# EAGLE board PinHeck Test Jig (EAGLE 6.6.0), part 1 of 2
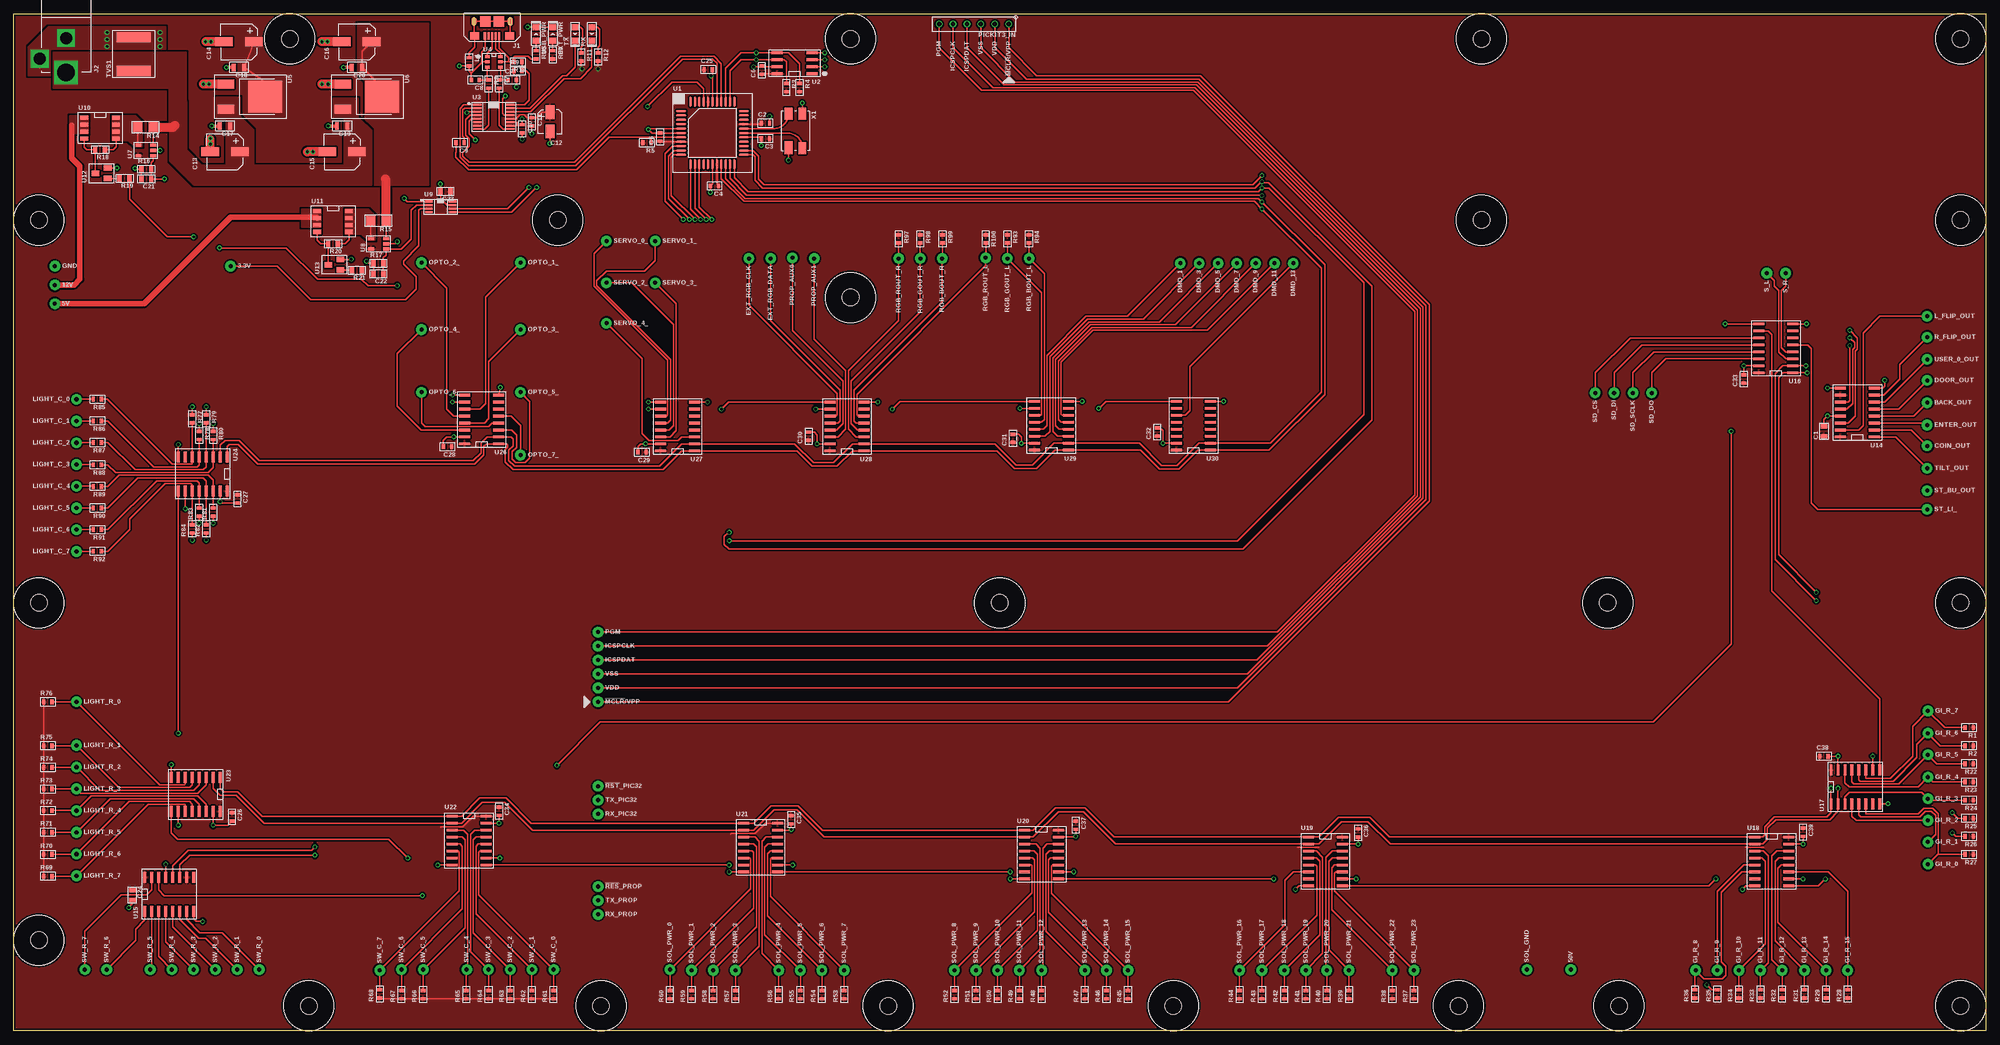
[diagram p8: board, top side]
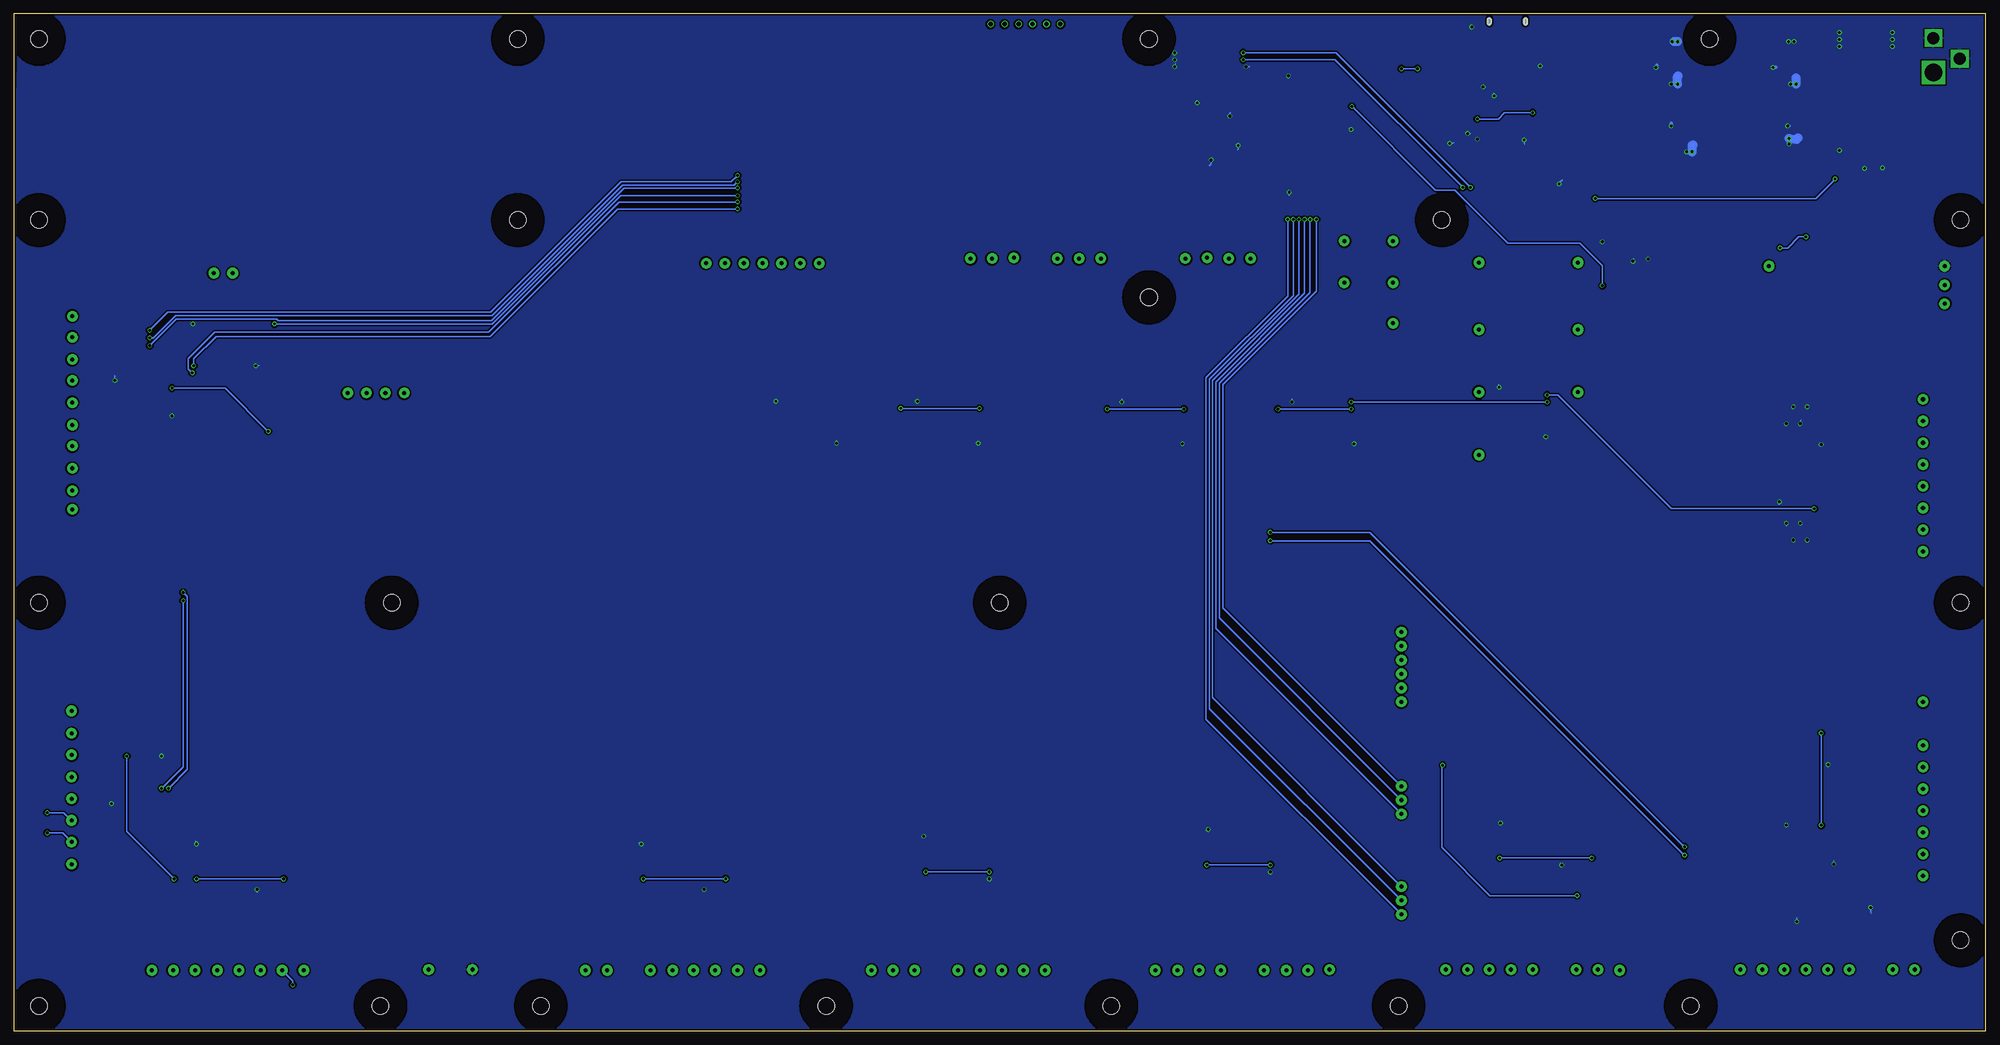
[diagram p9: board, bottom side, seen from below]

Size 359.16 x 185.29 mm. Coordinates in mm from the lower left corner, seen from the top.
Outline: 0,185.29 359.16,185.29 359.16,0 0,0 0,185.29
Copper layers (1*16): Top 0.035mm / dielectric 1.5mm / Bottom 0.035mm
Design rules "MF_Standard_2_Layer": minimum track width 6mil, minimum drill 12mil, track to track 6mil, track to pad 6mil, pad to pad 6mil, via to via 6mil, smd to smd 0mil, copper to edge 10mil, drill to drill 10mil, minimum pad ring 6mil, minimum via ring 6mil, stop-mask expansion 2mil, vias tented up to drill 25mil, thermal gap 10mil
Net classes: 0 default: width 0.254 mm, drill 0.5 mm, clearance 0.152 mm

## Footprints (pad centres in the part's own frame; a part is rotated, then mirrored left to right if it is on the bottom)
0914-3-15-20-77-14-11-0 = drill 0.737 pad 1.93: P$1 0,0
0805 = smd 0.8 x 1.2: 1 -0.9,0; 2 0.9,0
C0603 = smd 0.6 x 0.9: P$1 -0.75,0; P$2 0.75,0
CP4MM = smd 1.6 x 2.5: P$1 0,-1.75; P$2 0,1.75
CP6.3MM = smd 1.6 x 3.2: P$1 0,-2.7; P$2 0,2.7
C0805 = smd 0.7 x 1.3: P$1 -0.95,0; P$2 0.95,0
LED0805 = smd 1.1 x 1.25: ANODE 1.25,0; CATHODE -1.25,0
MOUNT_HOLE_120MIL = hole 3.048: 0,0
MICROUSB-RIGHT = smd 0.4 x 1.35: 1 -1.3,1.27; 2 -0.65,1.27; 3 0,1.27; 4 0.65,1.27; 5 1.3,1.27 | smd 0.9 x 1.6: S1 -3.3,-1.4; S2 3.3,-1.4 | smd 1.6 x 1.4: S3 -3.2,1.27; S4 3.2,1.27 | smd 1.9 x 1.9: S5 -1.2,-1.405; S6 1.2,-1.405 | smd 0.9 x 1.6 bottom: S7 -3.3,-1.4; S8 3.3,-1.4
DC_PWR_JACK = drill 3.2 square: PIN 6.25,0 | drill 2.2 square: SLEEVE1 0,0; SLEEVE2 3.75,-4.8
L0603 = smd 0.6 x 0.9: P$1 -0.75,0; P$2 0.75,0
2.54MM_01X06_PIN_HEADER = drill 0.8: 1 -6.35,0; 2 -3.81,0; 3 -1.27,0; 4 1.27,0; 5 3.81,0; 6 6.35,0
R0603 = smd 0.6 x 0.9: P$1 -0.75,0; P$2 0.75,0
1206 = smd 1.6 x 1.8: 1 -1.4,0; 2 1.4,0
2220 = smd 1.85 x 6.2: P$1 -3.075,0; P$2 3.075,0
LQFP44 = smd 1.9 x 0.4: 1 -5.7,4; 2 -5.7,3.2; 3 -5.7,2.4; 4 -5.7,1.6; 5 -5.7,0.8; 6 -5.7,0; 7 -5.7,-0.8; 8 -5.7,-1.6; 9 -5.7,-2.4; 10 -5.7,-3.2; 11 -5.7,-4; 23 5.7,-4; 24 5.7,-3.2; 25 5.7,-2.4; 26 5.7,-1.6; 27 5.7,-0.8; 28 5.7,0; 29 5.7,0.8; 30 5.7,1.6; 31 5.7,2.4; 32 5.7,3.2; 33 5.7,4 | smd 0.4 x 1.9: 12 -4,-5.7; 13 -3.2,-5.7; 14 -2.4,-5.7; 15 -1.6,-5.7; 16 -0.8,-5.7; 17 0,-5.7; 18 0.8,-5.7; 19 1.6,-5.7; 20 2.4,-5.7; 21 3.2,-5.7; 22 4,-5.7; 34 4,5.7; 35 3.2,5.7; 36 2.4,5.7; 37 1.6,5.7; 38 0.8,5.7; 39 0,5.7; 40 -0.8,5.7; 41 -1.6,5.7; 42 -2.4,5.7; 43 -3.2,5.7; 44 -4,5.7
SOIC-8_W = smd 2 x 0.5: 1 -3.185,1.905; 2 -3.185,0.635; 3 -3.185,-0.635; 4 -3.185,-1.905; 5 3.185,-1.905; 6 3.185,-0.635; 7 3.185,0.635; 8 3.185,1.905
SSOP16 = smd 1.5 x 0.3: 1 -3,2.223; 2 -3,1.587; 3 -3,0.953; 4 -3,0.318; 5 -3,-0.318; 6 -3,-0.953; 7 -3,-1.587; 8 -3,-2.223; 9 3,-2.223; 10 3,-1.587; 11 3,-0.953; 12 3,-0.318; 13 3,0.318; 14 3,0.953; 15 3,1.587; 16 3,2.223
IP4234CZ6_SOT-457-6 = smd 0.8 x 0.55: 1 -1.2,0.95; 2 -1.2,0; 3 -1.2,-0.95; 4 1.2,-0.95; 5 1.2,0; 6 1.2,0.95
NCP1117DT_DPAK-3 = smd 1.6 x 3: 1 -2.285,-3.81; 3 2.285,-3.81 | smd 5.8 x 6.2: TAB 0,3.37
INA169NA/250_SOT-23-5 = smd 0.6 x 1.05: 1 -0.95,-2.54; 2 0,-2.54; 3 0.95,-2.54; 4 0.95,0.16; 5 -0.95,0.16
MAX11613_UMAX-8 = smd 1.35 x 0.4: P$1 -2.15,0.975; P$2 -2.15,0.325; P$3 -2.15,-0.325; P$4 -2.15,-0.975; P$5 2.15,-0.975; P$6 2.15,-0.325; P$7 2.15,0.325; P$8 2.15,0.975
DSO-8 = smd 1.4 x 0.75: 1 -2.9,1.905; 2 -2.9,0.635; 3 -2.9,-0.635; 4 -2.9,-1.905; 5 2.9,-1.905; 6 2.9,-0.635; 7 2.9,0.635; 8 2.9,1.905
SOT-23-3 = smd 1 x 1.4: 1 -0.95,-1.1; 2 0.95,-1.1; 3 0,1.1
CD74HC595_SOIC-16 = smd 2 x 0.5: 1 -3.1,4.445; 2 -3.1,3.175; 3 -3.1,1.905; 4 -3.1,0.635; 5 -3.1,-0.635; 6 -3.1,-1.905; 7 -3.1,-3.175; 8 -3.1,-4.445; 9 3.1,-4.445; 10 3.1,-3.175; 11 3.1,-1.905; 12 3.1,-0.635; 13 3.1,0.635; 14 3.1,1.905; 15 3.1,3.175; 16 3.1,4.445
CD74HC165_SOIC-16 = smd 2 x 0.5: 1 -3.1,4.445; 2 -3.1,3.175; 3 -3.1,1.905; 4 -3.1,0.635; 5 -3.1,-0.635; 6 -3.1,-1.905; 7 -3.1,-3.175; 8 -3.1,-4.445; 9 3.1,-4.445; 10 3.1,-3.175; 11 3.1,-1.905; 12 3.1,-0.635; 13 3.1,0.635; 14 3.1,1.905; 15 3.1,3.175; 16 3.1,4.445
7MMX5MM = smd 2.2 x 1.4: P$1 -3.15,-1.27; P$2 -3.15,1.27; P$3 3.15,1.27 | smd 2.4 x 1.4: P$4 3.05,-1.27

## Placement (x,y rotation side)
3.3V  0914-3-15-20-77-14-11-0  [0914-3-15-20-77-14-11-0]  39.5,139.32 0 top
5V  0914-3-15-20-77-14-11-0  [0914-3-15-20-77-14-11-0]  7.49,132.46 0 top
12V  0914-3-15-20-77-14-11-0  [0914-3-15-20-77-14-11-0]  7.49,135.89 0 top
50V  0914-3-15-20-77-14-11-0  [0914-3-15-20-77-14-11-0]  283.59,11.18 90 top
!MCLR!/VPP  [0914-3-15-20-77-14-11-0]  106.43,59.94 0 top
!RES!_PROP  0914-3-15-20-77-14-11-0  [0914-3-15-20-77-14-11-0]  106.43,26.29 0 top
!RST!_PIC32  0914-3-15-20-77-14-11-0  [0914-3-15-20-77-14-11-0]  106.43,44.58 0 top
BACK_OUT  0914-3-15-20-77-14-11-0  [0914-3-15-20-77-14-11-0]  348.49,114.43 0 top
C1  0.1uF  [0805]  329.69,109.22 90 top
C2  0.1uF  [C0603]  136.91,165.35 0 top
C3  0.1uF  [C0603]  136.91,162.56 180 top
C4  0.1uF  [C0603]  127.64,153.92 180 top
C5  0.1uF  [C0603]  117.73,162.81 90 top
C6  0.1uF  [C0603]  136.27,175.01 90 top
C7  47pF  [C0603]  90.81,173.23 0 top
C8  47pF  [C0603]  84.07,173.23 180 top
C9  0.1uF  [C0603]  81.28,161.8 180 top
C10  0.1uF  [C0603]  92.58,164.34 270 top
C11  0.1uF  [C0603]  94.36,165.61 270 top
C12  4.7uF  [CP4MM]  97.66,165.61 180 top
C13  100uF  [CP6.3MM]  38.48,160.15 90 top
C14  100uF  [CP6.3MM]  41.02,180.21 90 top
C15  100uF  [CP6.3MM]  59.82,160.15 90 top
C16  100uF  [CP6.3MM]  62.48,180.21 90 top
C17  1uF  [C0805]  38.48,164.85 180 top
C18  1uF  [C0805]  41.02,175.51 180 top
C19  1uF  [C0805]  59.82,164.85 180 top
C20  1uF  [C0805]  62.48,175.51 180 top
C21  0.1uF  [0805]  24.13,155.19 180 top
C22  0.1uF  [0805]  66.42,137.92 180 top
C23  0.1uF  [0805]  78.61,152.91 180 top
C24  0.1uF  [0805]  21.59,24.77 270 top
C25  0.1uF  [C0603]  126.49,175.13 0 top
C26  0.1uF  [C0603]  39.75,38.99 270 top
C27  0.1uF  [C0603]  40.77,96.9 270 top
C28  0.1uF  [C0603]  78.99,106.43 180 top
C29  0.1uF  [C0603]  114.43,105.41 180 top
C30  0.1uF  [C0603]  144.78,108.33 90 top
C31  0.1uF  [C0603]  181.99,107.95 90 top
C32  0.1uF  [C0603]  208.28,109.09 90 top
C33  0.1uF  [C0603]  315.09,118.75 90 top
C34  0.1uF  [C0603]  88.39,40.01 270 top
C35  0.1uF  [C0603]  141.6,38.48 270 top
C36  0.1uF  [C0603]  244.86,36.07 270 top
C37  0.1uF  [C0603]  193.42,37.47 270 top
C38  0.1uF  [C0603]  329.69,50.04 0 top
C39  0.1uF  [C0603]  325.88,36.2 270 top
COIN_OUT  0914-3-15-20-77-14-11-0  [0914-3-15-20-77-14-11-0]  348.49,106.55 0 top
DMD_1  0914-3-15-20-77-14-11-0  [0914-3-15-20-77-14-11-0]  212.47,139.83 270 top
DMD_3  0914-3-15-20-77-14-11-0  [0914-3-15-20-77-14-11-0]  215.9,139.83 270 top
DMD_5  0914-3-15-20-77-14-11-0  [0914-3-15-20-77-14-11-0]  219.33,139.83 270 top
DMD_7  0914-3-15-20-77-14-11-0  [0914-3-15-20-77-14-11-0]  222.76,139.83 270 top
DMD_9  0914-3-15-20-77-14-11-0  [0914-3-15-20-77-14-11-0]  226.19,139.83 270 top
DMD_11  0914-3-15-20-77-14-11-0  [0914-3-15-20-77-14-11-0]  229.62,139.83 270 top
DMD_13  0914-3-15-20-77-14-11-0  [0914-3-15-20-77-14-11-0]  233.04,139.83 270 top
DOOR_OUT  0914-3-15-20-77-14-11-0  [0914-3-15-20-77-14-11-0]  348.49,118.49 0 top
ENTER_OUT  0914-3-15-20-77-14-11-0  [0914-3-15-20-77-14-11-0]  348.49,110.36 0 top
EXT_PWR  MF_LED_0805_RED  [LED0805]  98.17,181.61 270 top
EXT_RGB_CLK  0914-3-15-20-77-14-11-0  [0914-3-15-20-77-14-11-0]  133.89,140.72 270 top
EXT_RGB_DATA  0914-3-15-20-77-14-11-0  [0914-3-15-20-77-14-11-0]  137.85,140.72 270 top
GI_R_0  0914-3-15-20-77-14-11-0  [0914-3-15-20-77-14-11-0]  348.62,30.35 0 top
GI_R_1  0914-3-15-20-77-14-11-0  [0914-3-15-20-77-14-11-0]  348.62,34.42 0 top
GI_R_2  0914-3-15-20-77-14-11-0  [0914-3-15-20-77-14-11-0]  348.62,38.35 0 top
GI_R_3  0914-3-15-20-77-14-11-0  [0914-3-15-20-77-14-11-0]  348.62,42.29 0 top
GI_R_4  0914-3-15-20-77-14-11-0  [0914-3-15-20-77-14-11-0]  348.62,46.23 0 top
GI_R_5  0914-3-15-20-77-14-11-0  [0914-3-15-20-77-14-11-0]  348.62,50.29 0 top
GI_R_6  0914-3-15-20-77-14-11-0  [0914-3-15-20-77-14-11-0]  348.62,54.23 0 top
GI_R_7  0914-3-15-20-77-14-11-0  [0914-3-15-20-77-14-11-0]  348.62,58.29 0 top
GI_R_8  0914-3-15-20-77-14-11-0  [0914-3-15-20-77-14-11-0]  306.32,11.05 90 top
GI_R_9  0914-3-15-20-77-14-11-0  [0914-3-15-20-77-14-11-0]  310.26,11.05 90 top
GI_R_10  0914-3-15-20-77-14-11-0  [0914-3-15-20-77-14-11-0]  314.2,11.05 90 top
GI_R_11  0914-3-15-20-77-14-11-0  [0914-3-15-20-77-14-11-0]  318.13,11.05 90 top
GI_R_12  0914-3-15-20-77-14-11-0  [0914-3-15-20-77-14-11-0]  322.07,11.05 90 top
GI_R_13  0914-3-15-20-77-14-11-0  [0914-3-15-20-77-14-11-0]  326.14,11.05 90 top
GI_R_14  0914-3-15-20-77-14-11-0  [0914-3-15-20-77-14-11-0]  330.07,11.05 90 top
GI_R_15  0914-3-15-20-77-14-11-0  [0914-3-15-20-77-14-11-0]  334.01,11.05 90 top
GND  0914-3-15-20-77-14-11-0  [0914-3-15-20-77-14-11-0]  7.49,139.32 0 top
H1  2263-2  [MOUNT_HOLE_120MIL]  159.26,4.57 0 top
H2  2263-2  [MOUNT_HOLE_120MIL]  4.57,16.51 0 top
H3  2263-2  [MOUNT_HOLE_120MIL]  211.2,4.57 0 top
H4  2263-2  [MOUNT_HOLE_120MIL]  4.57,77.98 0 top
H5  2263-2  [MOUNT_HOLE_120MIL]  263.14,4.57 0 top
H6  2263-2  [MOUNT_HOLE_120MIL]  4.57,147.7 0 top
H7  2263-2  [MOUNT_HOLE_120MIL]  290.32,77.98 0 top
H8  2263-2  [MOUNT_HOLE_120MIL]  99.06,147.7 0 top
H9  2263-2  [MOUNT_HOLE_120MIL]  267.33,147.7 0 top
H10  2263-2  [MOUNT_HOLE_120MIL]  53.72,4.57 0 top
H11  2263-2  [MOUNT_HOLE_120MIL]  292.35,4.57 0 top
H12  2263-2  [MOUNT_HOLE_120MIL]  106.93,4.57 0 top
H13  2263-2  [MOUNT_HOLE_120MIL]  354.58,4.57 0 top
H14  2263-2  [MOUNT_HOLE_120MIL]  354.58,77.98 0 top
H15  2263-2  [MOUNT_HOLE_120MIL]  354.58,147.7 0 top
H16  2263-2  [MOUNT_HOLE_120MIL]  152.4,133.6 0 top
H17  2263-2  [MOUNT_HOLE_120MIL]  179.58,77.98 0 top
H18  2263-2  [MOUNT_HOLE_120MIL]  50.29,180.72 0 top
H19  2263-2  [MOUNT_HOLE_120MIL]  152.4,180.72 0 top
H20  2263-2  [MOUNT_HOLE_120MIL]  267.33,180.72 0 top
H21  2263-2  [MOUNT_HOLE_120MIL]  354.58,180.72 0 top
ICSPCLK  [0914-3-15-20-77-14-11-0]  106.43,70.1 0 top
ICSPDAT  [0914-3-15-20-77-14-11-0]  106.43,67.56 0 top
J1  [MICROUSB-RIGHT]  87.12,182.5 180 top
J2  [DC_PWR_JACK]  9.53,180.85 270 top
L1  MI0603K300R-10  [L0603]  82.93,176.53 270 top
L_FLIP_OUT  0914-3-15-20-77-14-11-0  [0914-3-15-20-77-14-11-0]  348.49,130.18 0 top
LIGHT_C_0  0914-3-15-20-77-14-11-0  [0914-3-15-20-77-14-11-0]  11.43,115.06 180 top
LIGHT_C_1  0914-3-15-20-77-14-11-0  [0914-3-15-20-77-14-11-0]  11.43,111.1 180 top
LIGHT_C_2  0914-3-15-20-77-14-11-0  [0914-3-15-20-77-14-11-0]  11.43,107.14 180 top
LIGHT_C_3  0914-3-15-20-77-14-11-0  [0914-3-15-20-77-14-11-0]  11.43,103.18 180 top
LIGHT_C_4  0914-3-15-20-77-14-11-0  [0914-3-15-20-77-14-11-0]  11.43,99.22 180 top
LIGHT_C_5  0914-3-15-20-77-14-11-0  [0914-3-15-20-77-14-11-0]  11.43,95.26 180 top
LIGHT_C_6  0914-3-15-20-77-14-11-0  [0914-3-15-20-77-14-11-0]  11.43,91.3 180 top
LIGHT_C_7  0914-3-15-20-77-14-11-0  [0914-3-15-20-77-14-11-0]  11.43,87.34 180 top
LIGHT_R_0  0914-3-15-20-77-14-11-0  [0914-3-15-20-77-14-11-0]  11.43,59.94 0 top
LIGHT_R_1  0914-3-15-20-77-14-11-0  [0914-3-15-20-77-14-11-0]  11.43,52.01 0 top
LIGHT_R_2  0914-3-15-20-77-14-11-0  [0914-3-15-20-77-14-11-0]  11.43,48.05 0 top
LIGHT_R_3  0914-3-15-20-77-14-11-0  [0914-3-15-20-77-14-11-0]  11.43,44.09 0 top
LIGHT_R_4  0914-3-15-20-77-14-11-0  [0914-3-15-20-77-14-11-0]  11.43,40.13 0 top
LIGHT_R_5  0914-3-15-20-77-14-11-0  [0914-3-15-20-77-14-11-0]  11.43,36.17 0 top
LIGHT_R_6  0914-3-15-20-77-14-11-0  [0914-3-15-20-77-14-11-0]  11.43,32.21 0 top
LIGHT_R_7  0914-3-15-20-77-14-11-0  [0914-3-15-20-77-14-11-0]  11.43,28.25 0 top
OPTO_1_  0914-3-15-20-77-14-11-0  [0914-3-15-20-77-14-11-0]  92.3,139.95 0 top
OPTO_2_  0914-3-15-20-77-14-11-0  [0914-3-15-20-77-14-11-0]  74.27,139.95 0 top
OPTO_3_  0914-3-15-20-77-14-11-0  [0914-3-15-20-77-14-11-0]  92.3,127.76 0 top
OPTO_4_  0914-3-15-20-77-14-11-0  [0914-3-15-20-77-14-11-0]  74.27,127.76 0 top
OPTO_5_  0914-3-15-20-77-14-11-0  [0914-3-15-20-77-14-11-0]  92.3,116.33 0 top
OPTO_6_  0914-3-15-20-77-14-11-0  [0914-3-15-20-77-14-11-0]  74.27,116.33 0 top
OPTO_7_  0914-3-15-20-77-14-11-0  [0914-3-15-20-77-14-11-0]  92.3,104.9 0 top
PGM  [0914-3-15-20-77-14-11-0]  106.43,72.64 0 top
PICKIT3_IN  [2.54MM_01X06_PIN_HEADER]  174.88,183.39 180 top
PROP_AUX0  0914-3-15-20-77-14-11-0  [0914-3-15-20-77-14-11-0]  141.81,140.84 270 top
PROP_AUX1  0914-3-15-20-77-14-11-0  [0914-3-15-20-77-14-11-0]  145.77,140.72 270 top
R1  10K  [R0603]  356.11,55.24 180 top
R2  10K  [R0603]  356.11,51.94 180 top
R3  10K  [R0603]  140.72,171.83 270 top
R4  10K  [R0603]  143.13,171.83 270 top
R5  10K  [R0603]  115.32,161.8 180 top
R7  27  [R0603]  88.39,172.47 270 top
R8  27  [R0603]  86.49,172.47 270 top
R9  10K  [R0603]  91.82,174.88 0 top
R10  470  [R0603]  95.12,177.8 270 top
R11  330  [R0603]  103.38,177.42 270 top
R12  330  [R0603]  106.43,177.42 270 top
R13  4.7K  [R0603]  91.82,176.53 180 top
R14  RL73H2BR10FTD  [1206]  24,164.59 180 top
R15  RL73H2BR10FTD  [1206]  66.42,147.57 180 top
R16  ERJ-6ENF3002V  [0805]  24.13,156.97 0 top
R17  ERJ-6ENF3002V  [0805]  66.42,139.83 0 top
R18  10K  [0805]  15.75,160.53 180 top
R19  10K  [0805]  20.19,155.32 180 top
R20  10K  [0805]  58.17,143.38 180 top
R21  10K  [0805]  62.48,138.56 180 top
R22  10K  [R0603]  356.11,48.64 180 top
R23  10K  [R0603]  356.11,45.34 180 top
R24  10K  [R0603]  356.11,42.04 180 top
R25  10K  [R0603]  356.11,38.73 180 top
R26  10K  [R0603]  356.11,35.43 180 top
R27  10K  [R0603]  356.11,32.13 180 top
R28  10K  [R0603]  334.01,6.73 90 top
R29  10K  [R0603]  330.07,6.73 90 top
R30  330  [R0603]  98.17,177.8 270 top
R31  10K  [R0603]  326.14,6.73 90 top
R32  10K  [R0603]  322.07,6.73 90 top
R33  10K  [R0603]  318.13,6.73 90 top
R34  10K  [R0603]  314.2,6.73 90 top
R35  10K  [R0603]  310.26,6.73 90 top
R36  10K  [R0603]  306.2,6.73 90 top
R37  10K  [R0603]  255.02,6.6 90 top
R38  10K  [R0603]  251.08,6.6 90 top
R39  10K  [R0603]  243.21,6.6 90 top
R40  10K  [R0603]  239.14,6.6 90 top
R41  10K  [R0603]  235.33,6.6 90 top
R42  10K  [R0603]  231.39,6.6 90 top
R43  10K  [R0603]  227.33,6.6 90 top
R44  10K  [R0603]  223.27,6.6 90 top
R45  10K  [R0603]  202.95,6.6 90 top
R46  10K  [R0603]  199.01,6.6 90 top
R47  10K  [R0603]  195.07,6.6 90 top
R48  10K  [R0603]  187.2,6.6 90 top
R49  10K  [R0603]  183.13,6.6 90 top
R50  10K  [R0603]  179.2,6.6 90 top
R51  10K  [R0603]  175.26,6.6 90 top
R52  10K  [R0603]  171.32,6.6 90 top
R53  10K  [R0603]  151.26,6.6 90 top
R54  10K  [R0603]  147.19,6.6 90 top
R55  10K  [R0603]  143.26,6.6 90 top
R56  10K  [R0603]  139.32,6.6 90 top
R57  10K  [R0603]  131.44,6.6 90 top
R58  10K  [R0603]  127.38,6.6 90 top
R59  10K  [R0603]  123.44,6.6 90 top
R60  10K  [R0603]  119.51,6.6 90 top
R61  10K  [R0603]  98.3,6.6 90 top
R62  10K  [R0603]  94.36,6.6 90 top
R63  10K  [R0603]  90.42,6.6 90 top
R64  10K  [R0603]  86.49,6.6 90 top
R65  10K  [R0603]  82.42,6.6 90 top
R66  10K  [R0603]  74.55,6.6 90 top
R67  10K  [R0603]  70.61,6.6 90 top
R68  10K  [R0603]  66.67,6.73 90 top
R69  10K  [R0603]  6.22,28.19 0 top
R70  10K  [R0603]  6.22,32.13 0 top
R71  10K  [R0603]  6.22,36.2 0 top
R72  10K  [R0603]  6.22,40.13 0 top
R73  10K  [R0603]  6.22,44.07 0 top
R74  10K  [R0603]  6.22,48.01 0 top
R75  10K  [R0603]  6.22,51.94 0 top
R76  10K  [R0603]  6.22,59.94 0 top
R77  10K  [R0603]  32.51,111.51 270 top
R78  10K  [R0603]  33.78,108.46 270 top
R79  10K  [R0603]  35.05,111.51 270 top
R80  10K  [R0603]  36.32,108.46 270 top
R81  10K  [R0603]  36.32,94.49 90 top
R82  10K  [R0603]  35.05,91.44 90 top
R83  10K  [R0603]  33.78,94.49 90 top
R84  10K  [R0603]  32.51,91.44 90 top
R85  30K  [R0603]  15.24,115.06 180 top
R86  30K  [R0603]  15.24,111.12 180 top
R87  30K  [R0603]  15.24,107.19 180 top
R88  30K  [R0603]  15.24,103.12 180 top
R89  30K  [R0603]  15.24,99.19 180 top
R90  30K  [R0603]  15.24,95.25 180 top
R91  30K  [R0603]  15.24,91.31 180 top
R92  30K  [R0603]  15.24,87.38 180 top
R93  10K  [R0603]  180.97,144.27 270 top
R94  10K  [R0603]  184.91,144.27 270 top
R97  10K  [R0603]  161.16,144.27 270 top
R98  10K  [R0603]  165.1,144.27 270 top
R99  10K  [R0603]  169.16,144.27 270 top
R100  10K  [R0603]  177.04,144.27 270 top
R_FLIP_OUT  0914-3-15-20-77-14-11-0  [0914-3-15-20-77-14-11-0]  348.49,126.36 0 top
RGB_BOUT_L  0914-3-15-20-77-14-11-0  [0914-3-15-20-77-14-11-0]  184.94,140.72 270 top
RGB_BOUT_R  0914-3-15-20-77-14-11-0  [0914-3-15-20-77-14-11-0]  169.09,140.72 270 top
RGB_GOUT_L  0914-3-15-20-77-14-11-0  [0914-3-15-20-77-14-11-0]  180.97,140.72 270 top
RGB_GOUT_R  0914-3-15-20-77-14-11-0  [0914-3-15-20-77-14-11-0]  165.13,140.72 270 top
RGB_ROUT_L  0914-3-15-20-77-14-11-0  [0914-3-15-20-77-14-11-0]  177.01,140.84 270 top
RGB_ROUT_R  0914-3-15-20-77-14-11-0  [0914-3-15-20-77-14-11-0]  161.18,140.72 270 top
RX  MF_LED_0805_RED  [LED0805]  105.28,181.61 90 top
RX_PIC32  0914-3-15-20-77-14-11-0  [0914-3-15-20-77-14-11-0]  106.43,39.5 0 top
RX_PROP  0914-3-15-20-77-14-11-0  [0914-3-15-20-77-14-11-0]  106.43,21.21 0 top
S_L  0914-3-15-20-77-14-11-0  [0914-3-15-20-77-14-11-0]  319.28,138.05 270 top
S_R  0914-3-15-20-77-14-11-0  [0914-3-15-20-77-14-11-0]  322.71,138.05 270 top
SD_CS  0914-3-15-20-77-14-11-0  [0914-3-15-20-77-14-11-0]  288.04,116.2 270 top
SD_DI  0914-3-15-20-77-14-11-0  [0914-3-15-20-77-14-11-0]  291.46,116.2 270 top
SD_DO  0914-3-15-20-77-14-11-0  [0914-3-15-20-77-14-11-0]  298.32,116.2 270 top
SD_SCLK  0914-3-15-20-77-14-11-0  [0914-3-15-20-77-14-11-0]  294.89,116.2 270 top
SERVO_0_  0914-3-15-20-77-14-11-0  [0914-3-15-20-77-14-11-0]  107.95,143.89 0 top
SERVO_1_  0914-3-15-20-77-14-11-0  [0914-3-15-20-77-14-11-0]  116.84,143.89 0 top
SERVO_2_  0914-3-15-20-77-14-11-0  [0914-3-15-20-77-14-11-0]  107.95,136.27 0 top
SERVO_3_  0914-3-15-20-77-14-11-0  [0914-3-15-20-77-14-11-0]  116.84,136.27 0 top
SERVO_4_  0914-3-15-20-77-14-11-0  [0914-3-15-20-77-14-11-0]  107.95,128.91 0 top
SOL_GND  0914-3-15-20-77-14-11-0  [0914-3-15-20-77-14-11-0]  275.59,11.18 90 top
SOL_PWR_0  0914-3-15-20-77-14-11-0  [0914-3-15-20-77-14-11-0]  119.51,11.18 90 top
SOL_PWR_1  0914-3-15-20-77-14-11-0  [0914-3-15-20-77-14-11-0]  123.44,11.05 90 top
SOL_PWR_2  0914-3-15-20-77-14-11-0  [0914-3-15-20-77-14-11-0]  127.38,11.05 90 top
SOL_PWR_3  0914-3-15-20-77-14-11-0  [0914-3-15-20-77-14-11-0]  131.44,11.05 90 top
SOL_PWR_4  0914-3-15-20-77-14-11-0  [0914-3-15-20-77-14-11-0]  139.32,11.05 90 top
SOL_PWR_5  0914-3-15-20-77-14-11-0  [0914-3-15-20-77-14-11-0]  143.26,11.05 90 top
SOL_PWR_6  0914-3-15-20-77-14-11-0  [0914-3-15-20-77-14-11-0]  147.19,11.05 90 top
SOL_PWR_7  0914-3-15-20-77-14-11-0  [0914-3-15-20-77-14-11-0]  151.26,11.05 90 top
SOL_PWR_8  0914-3-15-20-77-14-11-0  [0914-3-15-20-77-14-11-0]  171.32,11.05 90 top
SOL_PWR_9  0914-3-15-20-77-14-11-0  [0914-3-15-20-77-14-11-0]  175.26,11.05 90 top
SOL_PWR_10  0914-3-15-20-77-14-11-0  [0914-3-15-20-77-14-11-0]  179.2,11.05 90 top
SOL_PWR_11  0914-3-15-20-77-14-11-0  [0914-3-15-20-77-14-11-0]  183.13,11.05 90 top
SOL_PWR_12  0914-3-15-20-77-14-11-0  [0914-3-15-20-77-14-11-0]  187.2,11.05 90 top
SOL_PWR_13  0914-3-15-20-77-14-11-0  [0914-3-15-20-77-14-11-0]  195.07,11.05 90 top
SOL_PWR_14  0914-3-15-20-77-14-11-0  [0914-3-15-20-77-14-11-0]  199.01,11.05 90 top
SOL_PWR_15  0914-3-15-20-77-14-11-0  [0914-3-15-20-77-14-11-0]  202.95,11.05 90 top
SOL_PWR_16  0914-3-15-20-77-14-11-0  [0914-3-15-20-77-14-11-0]  223.27,11.05 90 top
SOL_PWR_17  0914-3-15-20-77-14-11-0  [0914-3-15-20-77-14-11-0]  227.33,11.05 90 top
SOL_PWR_18  0914-3-15-20-77-14-11-0  [0914-3-15-20-77-14-11-0]  231.39,11.05 90 top
SOL_PWR_19  0914-3-15-20-77-14-11-0  [0914-3-15-20-77-14-11-0]  235.33,11.05 90 top
SOL_PWR_20  0914-3-15-20-77-14-11-0  [0914-3-15-20-77-14-11-0]  239.14,11.05 90 top
SOL_PWR_21  0914-3-15-20-77-14-11-0  [0914-3-15-20-77-14-11-0]  243.21,11.05 90 top
SOL_PWR_22  0914-3-15-20-77-14-11-0  [0914-3-15-20-77-14-11-0]  251.08,11.05 90 top
SOL_PWR_23  0914-3-15-20-77-14-11-0  [0914-3-15-20-77-14-11-0]  255.02,11.05 90 top
ST_BU_OUT  0914-3-15-20-77-14-11-0  [0914-3-15-20-77-14-11-0]  348.49,98.42 0 top
ST_LI_  0914-3-15-20-77-14-11-0  [0914-3-15-20-77-14-11-0]  348.49,95 0 top
SW_C_0  0914-3-15-20-77-14-11-0  [0914-3-15-20-77-14-11-0]  98.34,11.18 90 top
SW_C_1  0914-3-15-20-77-14-11-0  [0914-3-15-20-77-14-11-0]  94.38,11.18 90 top
SW_C_2  0914-3-15-20-77-14-11-0  [0914-3-15-20-77-14-11-0]  90.42,11.18 90 top
SW_C_3  0914-3-15-20-77-14-11-0  [0914-3-15-20-77-14-11-0]  86.46,11.18 90 top
SW_C_4  0914-3-15-20-77-14-11-0  [0914-3-15-20-77-14-11-0]  82.5,11.18 90 top
SW_C_5  0914-3-15-20-77-14-11-0  [0914-3-15-20-77-14-11-0]  74.58,11.18 90 top
SW_C_6  0914-3-15-20-77-14-11-0  [0914-3-15-20-77-14-11-0]  70.62,11.18 90 top
SW_C_7  0914-3-15-20-77-14-11-0  [0914-3-15-20-77-14-11-0]  66.66,11.05 90 top
SW_R_0  0914-3-15-20-77-14-11-0  [0914-3-15-20-77-14-11-0]  44.7,11.18 90 top
SW_R_1  0914-3-15-20-77-14-11-0  [0914-3-15-20-77-14-11-0]  40.69,11.18 90 top
SW_R_2  0914-3-15-20-77-14-11-0  [0914-3-15-20-77-14-11-0]  36.73,11.18 90 top
SW_R_3  0914-3-15-20-77-14-11-0  [0914-3-15-20-77-14-11-0]  32.77,11.18 90 top
SW_R_4  0914-3-15-20-77-14-11-0  [0914-3-15-20-77-14-11-0]  28.81,11.18 90 top
SW_R_5  0914-3-15-20-77-14-11-0  [0914-3-15-20-77-14-11-0]  24.85,11.18 90 top
SW_R_6  0914-3-15-20-77-14-11-0  [0914-3-15-20-77-14-11-0]  16.93,11.18 90 top
SW_R_7  0914-3-15-20-77-14-11-0  [0914-3-15-20-77-14-11-0]  12.95,11.18 90 top
TILT_OUT  0914-3-15-20-77-14-11-0  [0914-3-15-20-77-14-11-0]  348.49,102.49 0 top
TVS1  V18AUMLA2220H  [2220]  21.84,177.93 90 top
TX  MF_LED_0805_RED  [LED0805]  102.23,181.61 90 top
TX_PIC32  0914-3-15-20-77-14-11-0  [0914-3-15-20-77-14-11-0]  106.43,42.04 0 top
TX_PROP  0914-3-15-20-77-14-11-0  [0914-3-15-20-77-14-11-0]  106.43,23.75 0 top
U1  P8X32A-Q44  [LQFP44]  127.25,163.58 0 top
U2  CAT24C512WI-GT3  [SOIC-8_W]  142.24,176.28 180 top
U3  FT230XS  [SSOP16]  87.44,166.5 0 top
U4  IP4234CZ6  [IP4234CZ6_SOT-457-6]  87.44,176.53 0 top
U5  NCP1117DT33G  [NCP1117DT_DPAK-3]  42.42,170.18 270 top
U6  NCP1117DT50G  [NCP1117DT_DPAK-3]  63.75,170.18 270 top
U7  INA139NA/3K  [INA169NA/250_SOT-23-5]  22.86,160.4 90 top
U8  INA139NA/3K  [INA169NA/250_SOT-23-5]  65.28,143.38 90 top
U9  MAX11613EUA+  [MAX11613_UMAX-8]  77.72,150.11 0 top
U10  BSO080P03NS3E G  [DSO-8]  15.75,164.47 0 top
U11  BSO080P03NS3E G  [DSO-8]  58.17,147.45 0 top
U12  MF-DSC-SOT233-MMBT3904  [SOT-23-3]  16,156.21 90 top
U13  MF-DSC-SOT233-MMBT3904  [SOT-23-3]  58.42,139.57 90 top
U14  CD74HC595M96  [CD74HC595_SOIC-16]  335.79,112.65 180 top
U15  CD74HC595M96  [CD74HC595_SOIC-16]  28.32,24.89 90 top
U16  CD74HC165M96  [CD74HC165_SOIC-16]  320.93,124.33 180 top
U17  CD74HC165M96  [CD74HC165_SOIC-16]  335.41,44.45 90 top
U18  CD74HC165M96  [CD74HC165_SOIC-16]  320.17,30.86 0 top
U19  CD74HC165M96  [CD74HC165_SOIC-16]  238.89,30.86 0 top
U20  CD74HC165M96  [CD74HC165_SOIC-16]  187.2,32.13 0 top
U21  CD74HC165M96  [CD74HC165_SOIC-16]  136.02,33.4 0 top
U22  CD74HC165M96  [CD74HC165_SOIC-16]  82.93,34.67 0 top
U23  CD74HC165M96  [CD74HC165_SOIC-16]  33.15,43.05 270 top
U24  CD74HC165M96  [CD74HC165_SOIC-16]  34.42,101.47 270 top
U26  CD74HC165M96  [CD74HC165_SOIC-16]  85.22,111.38 180 top
U27  CD74HC165M96  [CD74HC165_SOIC-16]  120.9,110.11 180 top
U28  CD74HC165M96  [CD74HC165_SOIC-16]  151.76,110.11 180 top
U29  CD74HC165M96  [CD74HC165_SOIC-16]  188.98,110.24 180 top
U30  CD74HC165M96  [CD74HC165_SOIC-16]  214.88,110.24 180 top
USB_PWR  MF_LED_0805_RED  [LED0805]  95.12,181.61 270 top
USER_0_OUT  0914-3-15-20-77-14-11-0  [0914-3-15-20-77-14-11-0]  348.49,122.3 0 top
VDD  [0914-3-15-20-77-14-11-0]  106.43,62.48 0 top
VSS  [0914-3-15-20-77-14-11-0]  106.43,65.02 0 top
X1  ABMM-6.000MHZ-B2-T  [7MMX5MM]  142.37,163.96 270 top